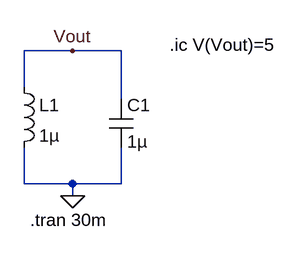
[diagram p0: schematic ee307_hw5_1b.asc]
ee307_hw5_1b.asc, the LTspice schematic file:
Version 4
SHEET 1 880 680
WIRE 176 16 112 16
WIRE 240 16 176 16
WIRE 112 64 112 16
WIRE 240 80 240 16
WIRE 112 192 112 144
WIRE 176 192 112 192
WIRE 240 192 240 144
WIRE 240 192 176 192
WIRE 176 208 176 192
FLAG 176 208 0
FLAG 176 16 Vout
SYMBOL ind 96 48 R0
SYMATTR InstName L1
SYMATTR Value 1µ
SYMATTR SpiceLine Rser=0 Rpar=0 Cpar=0
SYMBOL cap 224 80 R0
SYMATTR InstName C1
SYMATTR Value 1µ
SYMATTR SpiceLine Rser=0 Lser=0 Rpar=0 Cpar=0
TEXT 120 240 Left 2 !.tran 30m
TEXT 304 8 Left 2 !.ic V(Vout)=5

The netlist it stands for:
* ee307_hw5_1b.asc
L1 Vout 0 1µ Rser=0 Rpar=0 Cpar=0
C1 Vout 0 1µ Rser=0 Lser=0 Rpar=0 Cpar=0
.tran 30m
.ic V(Vout)=5
.backanno
.end